# EAGLE design sensors_board (EAGLE 5.11)

## Sheet 1 of 2
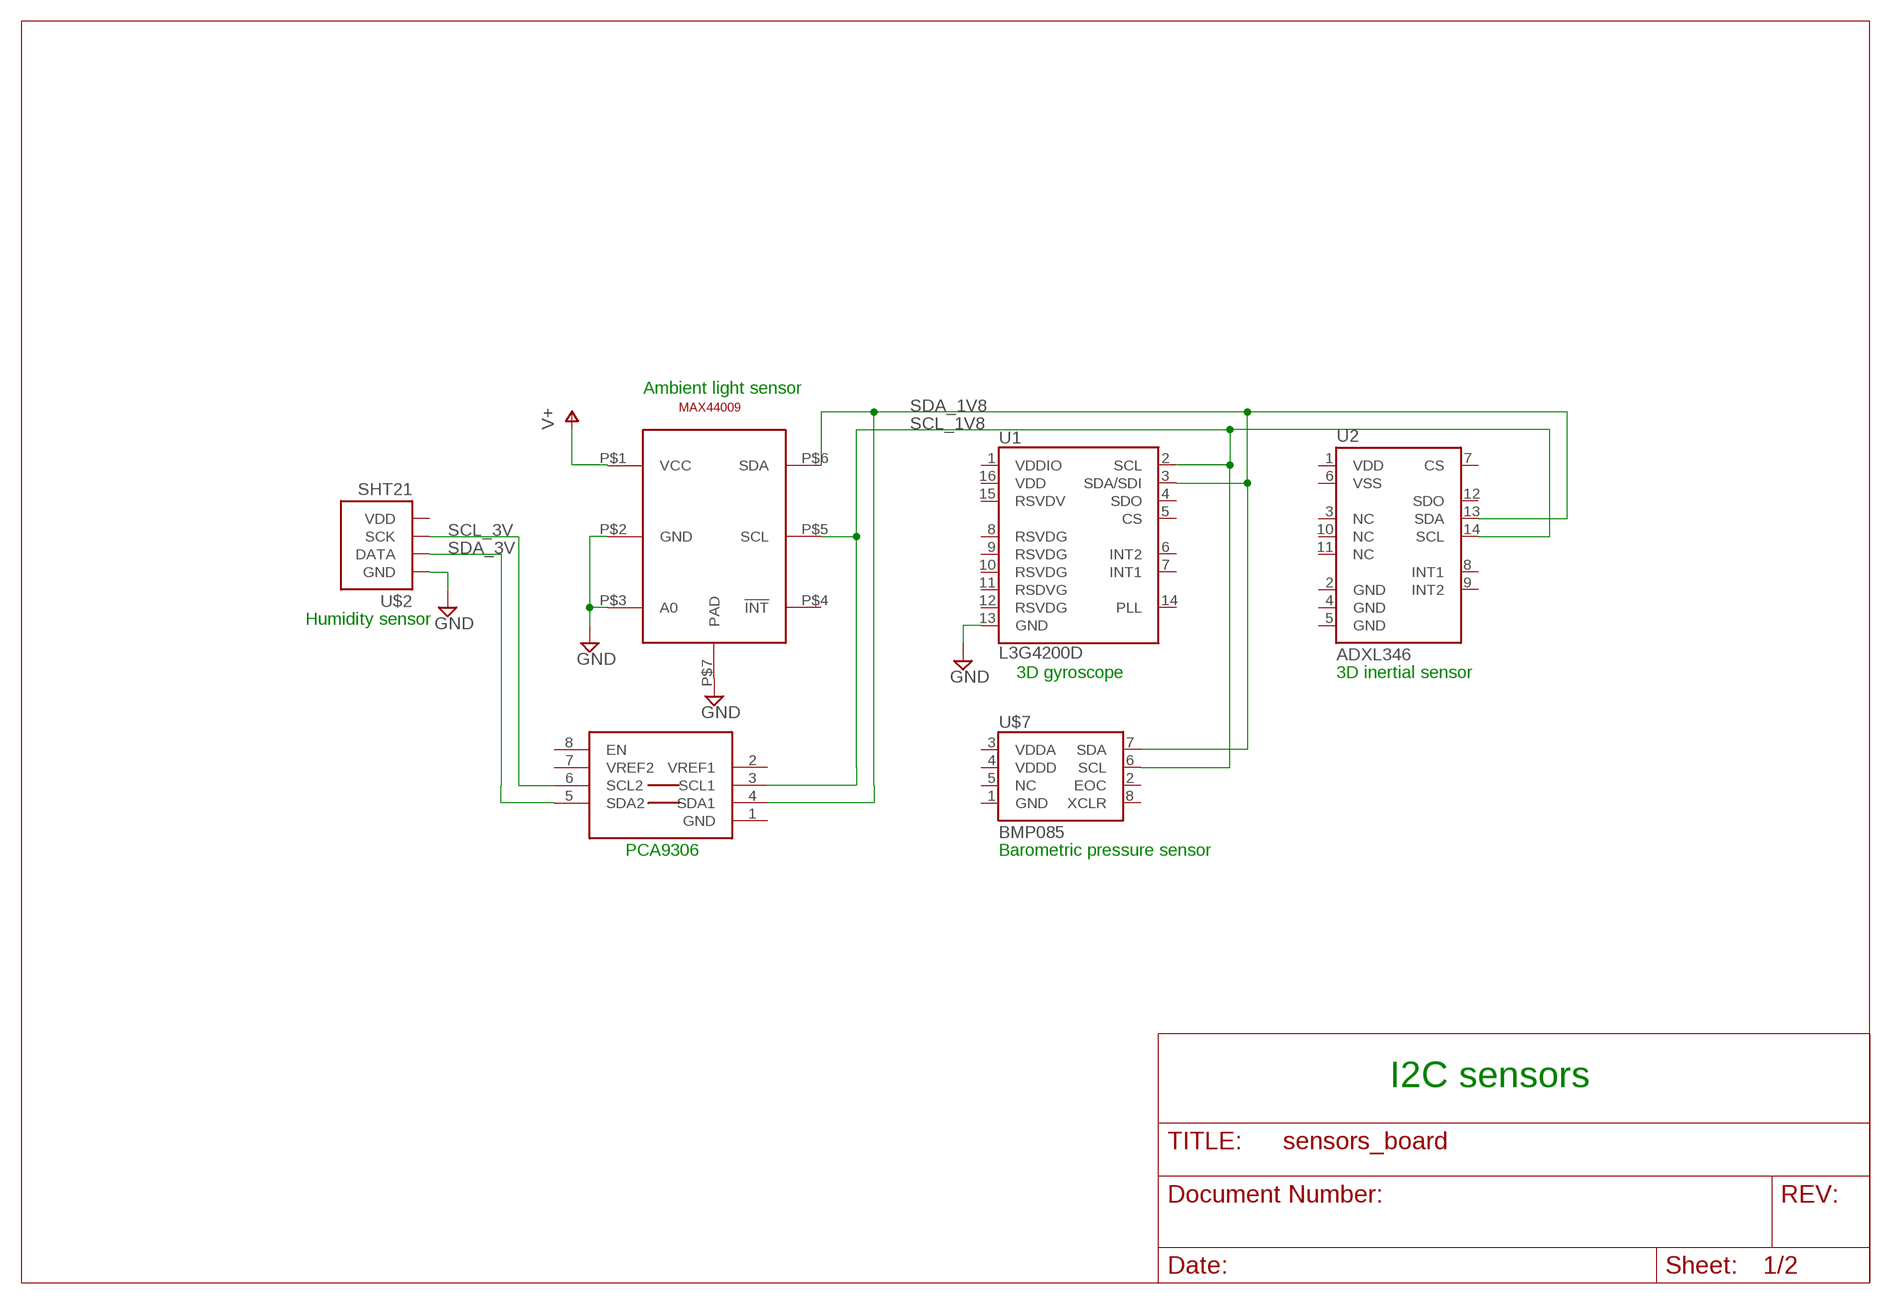
[diagram p0: schematic, sheet 1]

### Parts
U1  L3G4200D  [LGA16-4X4]
U2  ADXL346  ADXL345  [LGA14]
U$1  MAX44009EDT  [ODFN6]
U$2  SHT21  SHT1XSMD  [SHT1X]
U$6  PCA9306  [PSOP-8]
U$7  BMP085  [BMP085]

### Nets
GND: U1.13(GND) U$1.P$2(GND) U$1.P$3(A0) U$1.P$7(PAD) U$2.1(GND) ; also sheet 2
SCL_1V8: U1.2(SCL) U2.14(SCL) U$1.P$5(SCL) U$6.3(SCL1) U$7.6(SCL)
SCL_3V: U$2.3(SCK) U$6.6(SCL2)
SDA_1V8: U1.3(SDA/SDI) U2.13(SDA) U$1.P$6(SDA) U$6.4(SDA1) U$7.7(SDA)
SDA_3V: U$2.2(DATA) U$6.5(SDA2)
V+: U$1.P$1(VCC)
Unconnected: U1.1(VDDIO) U1.4(SDO) U1.5(CS) U1.6(INT2) U1.7(INT1) U1.8(RSVDG) U1.9(RSVDG) U1.10(RSVDG) U1.11(RSDVG) U1.12(RSVDG) U1.14(PLL) U1.15(RSVDV) U1.16(VDD) U2.1(VDD) U2.2(GND) U2.3(NC) U2.4(GND) U2.5(GND) U2.6(VSS) U2.7(CS) U2.8(INT1) U2.9(INT2) U2.10(NC) U2.11(NC) U2.12(SDO) U$1.P$4(!INT) U$6.1(GND) U$6.2(VREF1) U$6.7(VREF2) U$6.8(EN) U$7.2(EOC) U$7.5(NC) U$7.8(XCLR)

### Notes on the sheet
- Ambient light sensor
- Humidity sensor
- 3D gyroscope | 3D inertial sensor
- PCA9306 | Barometric pressure sensor
- I2C sensors

## Sheet 2 of 2
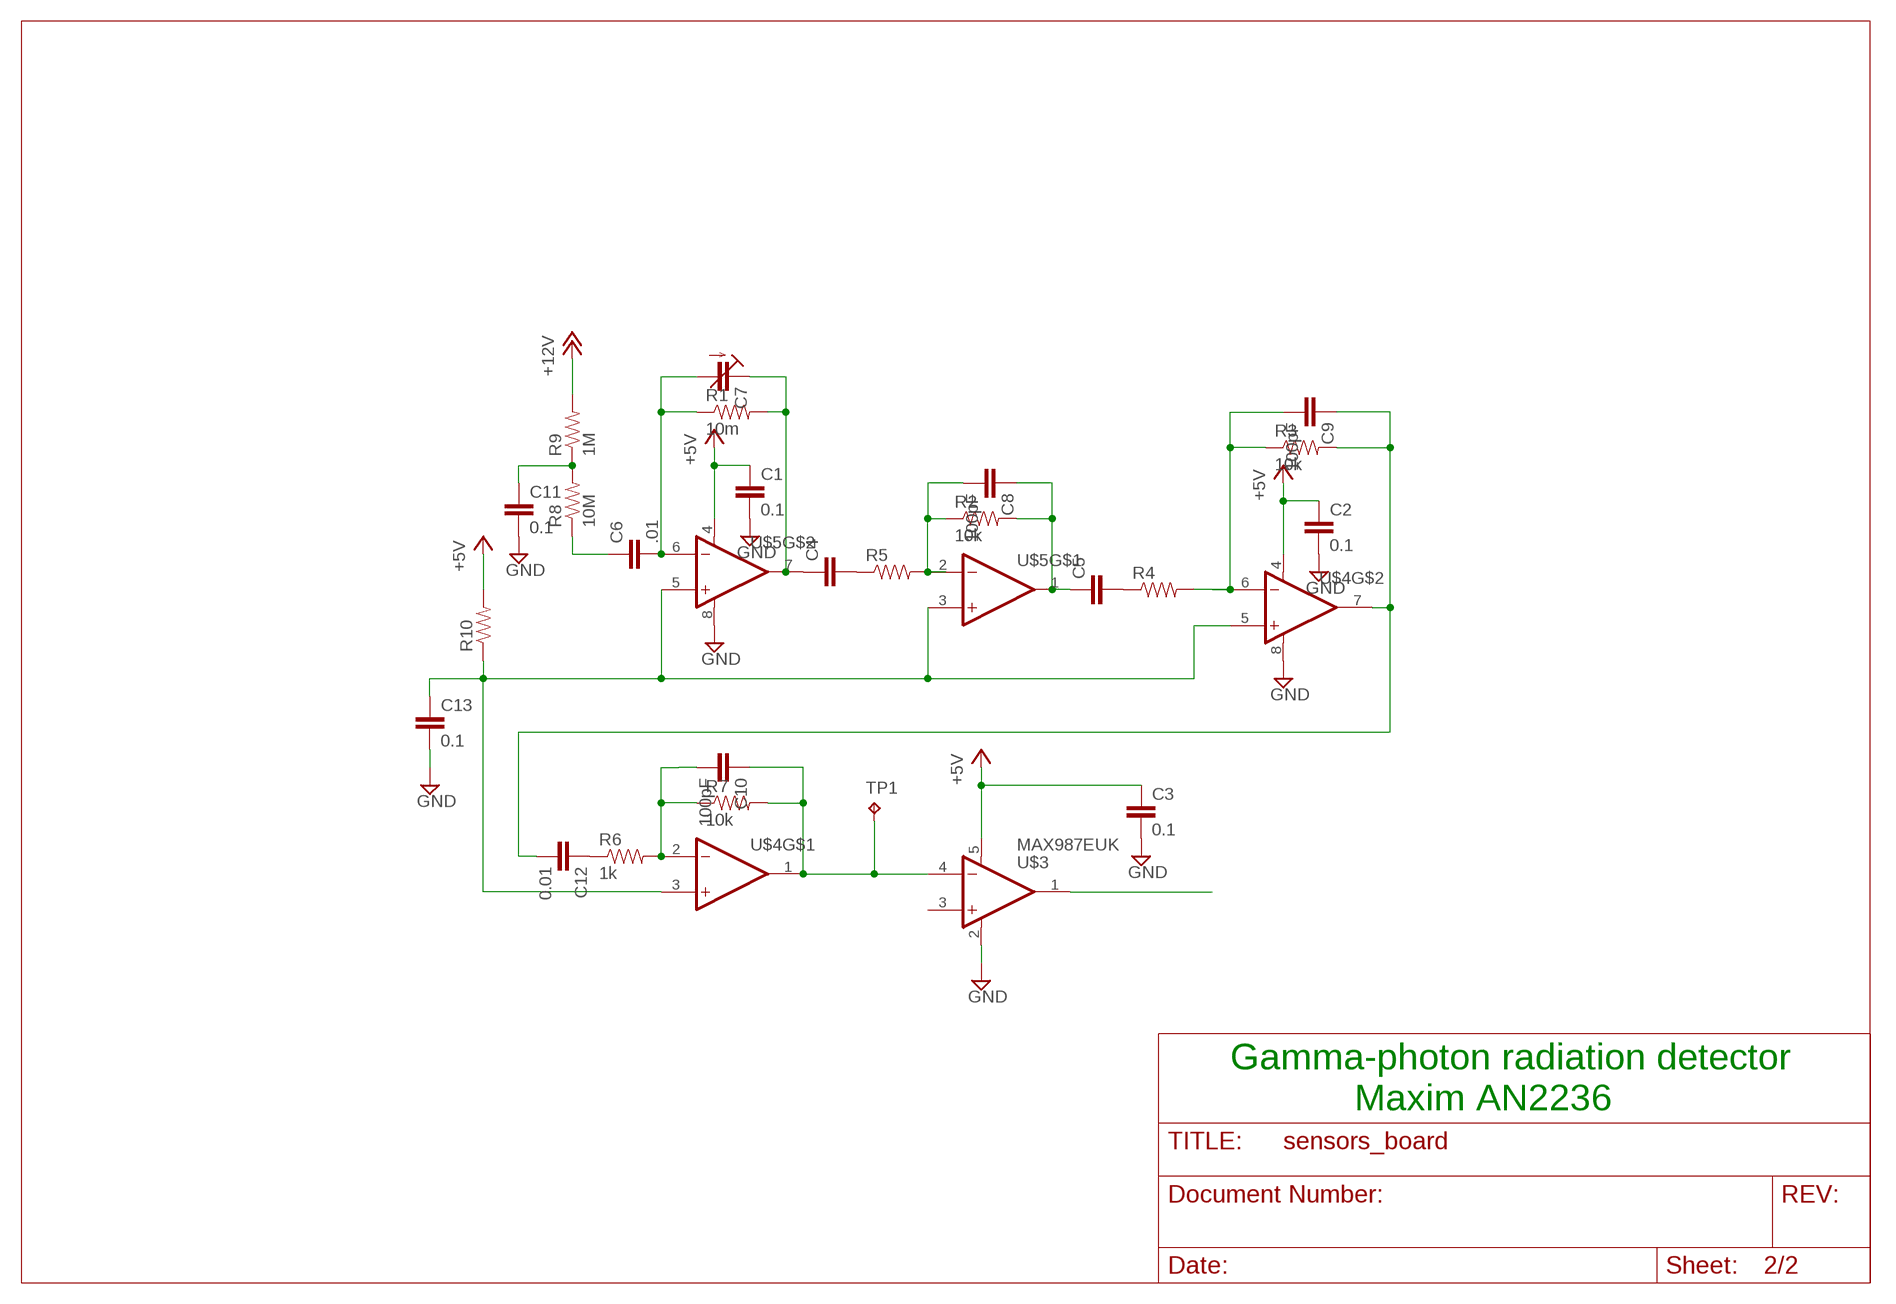
[diagram p1: schematic, sheet 2]

### Parts
C1  0.1  CAP0603-CAP  [0603-CAP]
C2  0.1  CAP0603-CAP  [0603-CAP]
C3  0.1  CAP0603-CAP  [0603-CAP]
C4  CAP0603-CAP  [0603-CAP]
C5  CAP0603-CAP  [0603-CAP]
C6  .01  CAP0603-CAP  [0603-CAP]
C7  C-TRIMM3018_11  [CTRIM3018_11]
C8  100pF  CAP0603-CAP  [0603-CAP]
C9  100pF  CAP0603-CAP  [0603-CAP]
C10  100pF  CAP0603-CAP  [0603-CAP]
C11  0.1  CAP0603-CAP  [0603-CAP]
C12  0.01  CAP0603-CAP  [0603-CAP]
C13  0.1  CAP0603-CAP  [0603-CAP]
R1  10m  RESISTOR0603-RES  [0603-RES]
R2  10k  RESISTOR0603-RES  [0603-RES]
R3  10k  RESISTOR0603-RES  [0603-RES]
R4  RESISTOR0603-RES  [0603-RES]
R5  RESISTOR0603-RES  [0603-RES]
R6  1k  RESISTOR0603-RES  [0603-RES]
R7  10k  RESISTOR0603-RES  [0603-RES]
R8  10M  RESISTOR0603-RES  [0603-RES]
R9  1M  RESISTOR0603-RES  [0603-RES]
R10  RESISTOR0603-RES  [0603-RES]
TP1  TPB1,27  [B1,27]
U$3  MAX987EUK  [SOT23-5]
U$4  MAX4477AUA  [UMAX8]
U$5  MAX4477AUA  [UMAX8]

### Nets
+5V: C1.1 C2.1 C3.1 R10.2 U$3.5(V-) U$4.4(V-) U$5.4(V-)
+12V: R9.2
GND: C1.2 C2.2 C3.2 C11.2 C13.2 U$3.2(V+) U$4.8(V+) U$5.8(V+) ; also sheet 1
N$1: C4.1 U$5.7(OUT)
N$2: C5.1 C8.1 R2.2 U$5.1(OUT)
N$4: C9.2 R3.1 R4.2 U$4.6(-IN)
N$5: U$3.1(OUT)
N$6: C10.2 R6.2 R7.1 U$4.2(-IN)
N$7: C11.1 R8.2 R9.1
N$9: C6.1 R8.1
N$10: C6.2 C7.-(A) R1.1 U$5.6(-IN)
N$11: C7.+(E) R1.2
N$12: C8.2 R2.1 R5.2 U$5.2(-IN)
N$15: C9.1 C12.2 R3.2 U$4.7(OUT)
N$16: C4.2 R5.1
N$17: C5.2 R4.1
N$18: C12.1 R6.1
N$19: C10.1 R7.2 TP1.TP U$3.4(-IN) U$4.1(OUT)
N$22: C13.1 R10.1 U$4.3(+IN) U$4.5(+IN) U$5.3(+IN) U$5.5(+IN)
Unconnected: U$3.3(+IN)

### Notes on the sheet
- Gamma-photon radiation detector
- Maxim AN2236

## Power pins joined to a net without a drawn wire
GND: U$7.1(GND)
VDD: U$2.4(VDD)
VDDA: U$7.3(VDDA)
VDDD: U$7.4(VDDD)

## Library data of the parts
C1-C6 C8-C13 = SparkFun:CAP: Capacitor Standard 0603 ceramic capacitor, and 0.1" leaded capacitor.
C7 = rcl:C-TRIMM: Trimm capacitor
R1-R10 = SparkFun:RESISTOR: Resistor Basic schematic elements and footprints for 0603, 1206, and PTH resistors.
TP1 = testpad:TP: Test pad
U1 = SparkFun:L3G4200D: L3G4200D Three-axis, digital output gyroscope The L3G4200D is a low-power three-axis angular rate sensor, has a full scale of ±250/±500/±2000 dps and is capable of measuring rates with a user-selectable bandwidth. It includes a sensing element and an IC interface capable of providing the measured angular rate to the external world through a digital interface (I2C/SPI). Package: 4x4x1.1 LGA-16 (LGA16-4x4.PAC)
U2 = SparkFun:ADXL345
U$1 = samuel:MAX44009EDT
U$2 = SparkFun:SHT1X: SHT1x Humdity Sensor Sensirion humdity sensor. Schematic element and footprint proven. Spark Fun Electronics SKU : COM-08227
U$3 = samuel:MAX987EUK
U$4 U$5 = samuel:MAX4477AUA
U$6 = SparkFun:PCA9306
U$7 = SparkFun:BMP085: BMP085 Pressure Sensor Great little MEMS pressure sensor. SKU: COM-09603

## Board
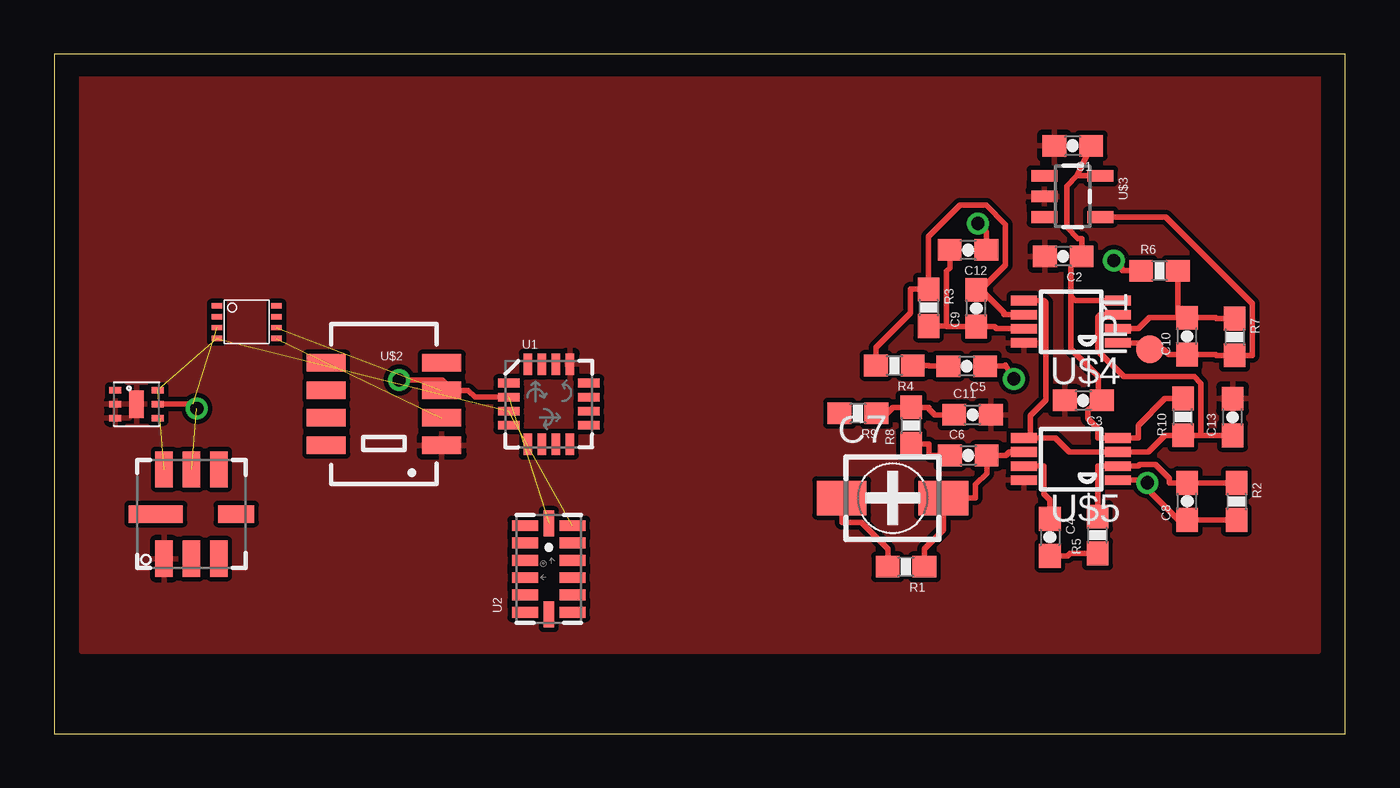
[diagram p2: board, top side]
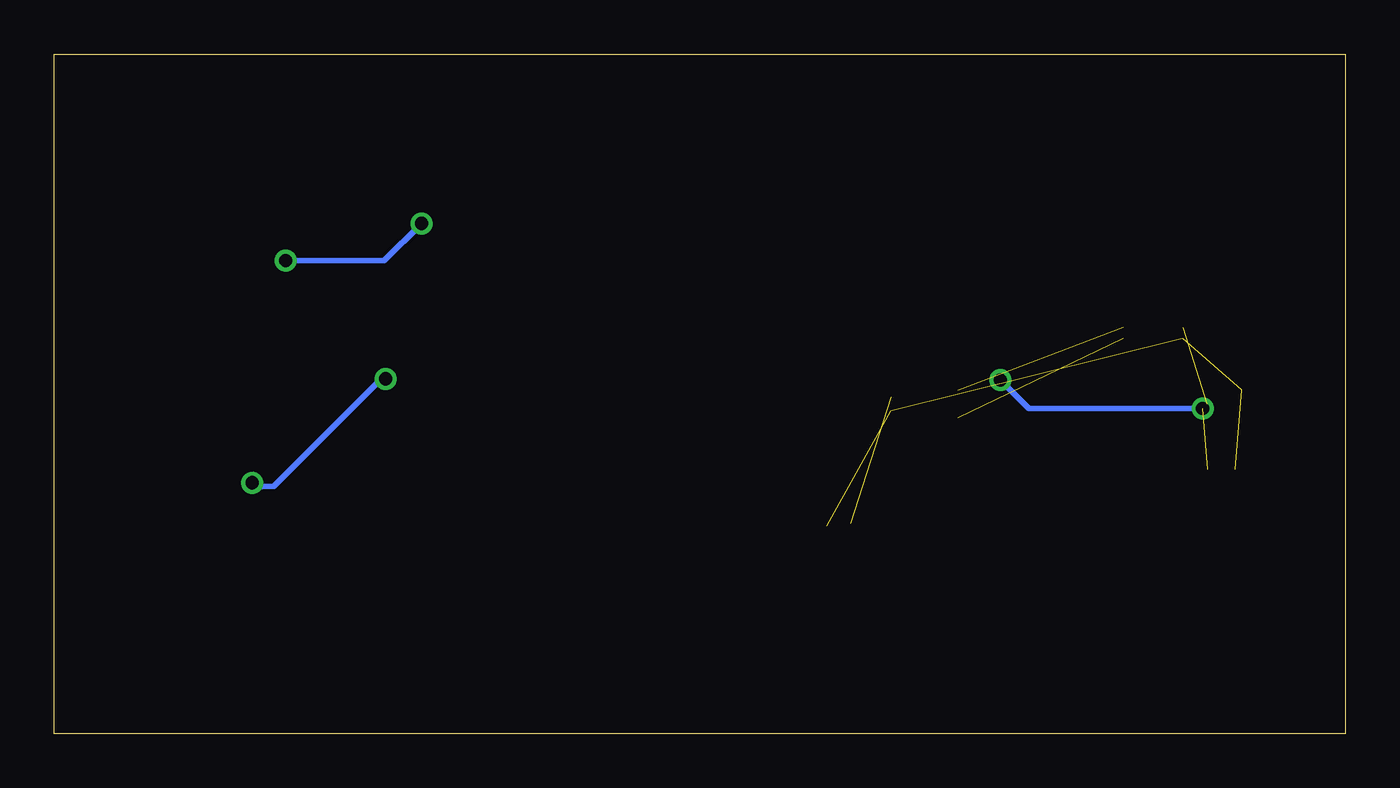
[diagram p3: board, bottom side, seen from below]

Size 59.67 x 31.42 mm. Coordinates in mm from the lower left corner, seen from the top.
Outline: 0,0 59.67,0 59.67,31.42 0,31.42 0,0
Copper layers (1*16): Top 0.035mm / dielectric 1.5mm / Bottom 0.035mm
Design rules "default": minimum track width 10mil, minimum drill 24mil, track to track 8mil, track to pad 8mil, pad to pad 8mil, via to via 8mil, smd to smd 8mil, copper to edge 40mil, drill to drill 8mil, minimum pad ring 10mil, minimum via ring 8mil, stop-mask expansion 4mil, vias tented up to drill 0mil, thermal gap 10mil

### Footprints (pad centres in the part's own frame; a part is rotated, then mirrored left to right if it is on the bottom)
0603-CAP = smd 1.1 x 1: 1 -0.85,0; 2 0.85,0
CTRIM3018_11 = smd 2.3 x 1.6: + -2.35,0; - 2.35,0
0603-RES = smd 1.1 x 1: 1 -0.85,0; 2 0.85,0
B1,27 = smd 1.27 x 1.27: TP 0,0
LGA16-4X4 = smd 1 x 0.4: 1 -1.85,0.975; 2 -1.85,0.325; 3 -1.85,-0.325; 4 -1.85,-0.975; 9 1.85,-0.975; 10 1.85,-0.325; 11 1.85,0.325; 12 1.85,0.975 | smd 0.4 x 1: 5 -0.975,-1.85; 6 -0.325,-1.85; 7 0.325,-1.85; 8 0.975,-1.85; 13 0.975,1.85; 14 0.325,1.85; 15 -0.325,1.85; 16 -0.975,1.85
LGA14 = smd 0.5 x 1.2: 1 2,1.1; 2 1.2,1.1; 3 0.4,1.1; 4 -0.4,1.1; 5 -1.2,1.1; 6 -2,1.1; 8 -2,-1.1; 9 -1.2,-1.1; 10 -0.4,-1.1; 11 0.4,-1.1; 12 1.2,-1.1; 13 2,-1.1 | smd 1.2 x 0.5: 7 -2.1,0; 14 2.1,0
ODFN6 = smd 0.55 x 0.3: P$1 -0.98,0.65; P$2 -0.98,0; P$3 -0.98,-0.65; P$4 0.98,-0.65; P$5 0.98,0; P$6 0.98,0.65 | smd 0.66 x 1.27: P$7 0,0
SHT1X = smd 1.8 x 0.8: 1 -2.667,1.905; 2 -2.667,0.635; 3 -2.667,-0.635; 4 -2.667,-1.905; 5 2.667,-1.905; 6 2.667,-0.635; 7 2.667,0.635; 8 2.667,1.905
SOT23-5 = smd 0.55 x 1.2: 1 -0.95,-1.3; 2 0,-1.3; 3 0.95,-1.3; 4 0.95,1.3; 5 -0.95,1.3
UMAX8 = smd 0.45 x 1.2: 1 -0.975,-2.175; 2 -0.325,-2.175; 3 0.325,-2.175; 4 0.975,-2.175; 5 0.975,2.175; 6 0.325,2.175; 7 -0.325,2.175; 8 -0.975,2.175
PSOP-8 = smd 0.25 x 0.5: 1 -0.73,-1.37; 2 -0.23,-1.37; 3 0.27,-1.37; 4 0.77,-1.37; 5 0.77,1.38; 6 0.27,1.38; 7 -0.23,1.38; 8 -0.73,1.38
BMP085 = smd 1.67 x 0.8: 1 -2.065,1.27; 2 -2.065,0; 3 -2.065,-1.27; 5 2.065,-1.27; 6 2.065,0; 7 2.065,1.27 | smd 0.8 x 1.67: 4 0,-2.065 | smd 0.8 x 2.5: 8 0,1.65

### Placement (x,y rotation side)
C1  47.07,27.18 180 top
C2  46.63,22.07 180 top
C3  47.56,15.41 180 top
C4  46.01,9.08 270 top
C5  42.17,16.99 180 top
C6  42.24,12.87 0 top
C7  38.75,10.9 0 top
C8  52.36,10.74 90 top
C9  42.61,19.68 90 top
C10  52.35,18.38 90 top
C11  42.44,14.75 0 top
C12  42.24,22.37 180 top
C13  54.46,14.64 90 top
R1  39.37,7.72 180 top
R2  54.63,10.74 270 top
R3  40.41,19.7 270 top
R4  38.83,17.02 180 top
R5  48.22,9.19 90 top
R6  51.08,21.41 0 top
R7  54.55,18.35 270 top
R8  39.6,14.25 90 top
R9  37.15,14.82 180 top
R10  52.17,14.65 90 top
TP1  50.63,17.78 90 top
U1  22.86,15.24 0 top
U2  22.86,7.62 90 top
U$1  3.81,15.24 0 top
U$2  15.24,15.24 180 top
U$3  47.06,24.84 270 top
U$4  46.99,19.05 90 top
U$5  46.99,12.7 90 top
U$6  8.89,19.05 270 top
U$7  6.35,10.16 90 top

### Tracks (layer width: path | path; a pad name or v marks a point on that pad's centre or on a via)
+5V
  Top 0.254: R10.2 51.34,15.5 50.09,14.26 50.09,13.68 U$5.4 48.23,13.68 48.23,14.12 47.78,14.58 47.78,15 C3.1 48.26,15.24 48.26,16.51 46.99,17.78 46.99,20.32 | 47.26,25.79 U$3.5 | 47.26,25.79 47.28,25.82 C1.1 | 47.26,25.79 46.79,25.33 46.79,23.42 47.31,22.9 47.48,22.9 C2.1 46.99,21.59 46.99,20.32 | U$4.4 47.28,20.02 arc-90 46.99,20.32
GND
  pour Top: 1.27,3.81 1.27,30.48 58.42,30.48 58.42,3.81
N$1
  Top 0.254: C4.1 46.02,10.81 45.74,11.08 45.74,12.38 U$5.7
N$2  (via drill 0.61 pad 1.02)
  Top 0.254: C5.1 43.9,16.99 43.95,17.05 v44.35,16.41 | U$5.1 49.63,11.72 50.4,11.72 v50.52,11.61 50.52,11.32 51.94,9.89 C8.1 53.8,9.89 R2.2
  Bottom 0.254: v44.35,16.41 44.45,16.51 49.53,11.43 50.8,11.43 v50.52,11.61
N$4
  Top 0.254: 42.82,20.53 43.97,21.68 43.97,23.54 43.07,24.43 41.87,24.43 40.41,22.97 R3.1 39.58,20.55 39.58,19.45 37.98,17.85 R4.2 | 42.82,20.53 43.88,19.46 43.88,19.38 U$4.6 | 42.82,20.53 C9.2
N$6
  Top 0.254: 51.93,19.23 C10.2 53.68,19.23 53.72,19.2 R7.1 | 51.93,19.23 50.6,19.23 50.09,18.73 U$4.2 | 51.93,19.23 R6.2
N$7
  Top 0.254: R9.1 38.5,14.82 38.77,15.1 R8.2 40.43,15.1 40.43,15.03 40.71,14.75 C11.1
N$9
  Top 0.254: R8.1 40.43,13.4 40.43,12.95 40.51,12.87 C6.1
N$10
  Top 0.254: U$5.6 44.13,13.03 43.97,12.87 C6.2 43.09,12.04 42.58,11.52 42.58,10.9 C7.- 41.1,9.43 40.22,8.55 R1.1
N$11
  Top 0.254: C7.+ 36.4,9.77 37.31,9.77 38.52,8.55 R1.2
N$12
  Top 0.254: R5.2 48.22,10.92 48.23,10.93 48.23,12.38 U$5.2 50.09,12.38 50.16,12.44 50.89,12.44 51.53,11.81 51.53,11.59 C8.2 53.8,11.59 R2.1
N$15
  Top 0.254: C12.2 41.39,21.54 41.24,21.39 41.24,18.85 | 41.24,18.85 41.26,18.83 C9.1 43.44,18.83 43.54,18.73 U$4.7 | R3.2 41.24,18.85
N$16
  Top 0.254: C4.2 46.84,8.23 46.95,8.34 R5.1
N$17
  Top 0.254: C5.2 40.44,16.99 40.41,17.02 R4.1
N$18  (via drill 0.61 pad 1.02)
  Top 0.254: R6.1 49.35,21.41 49.35,21.48 v48.97,21.87 | v42.69,23.6 43.09,23.2 C12.1
  Bottom 0.254: v42.69,23.6 44.41,21.87 v48.97,21.87
N$19
  Top 0.254: U$4.1 50.09,18.07 50.4,17.78 TP1.TP 51.28,17.78 51.52,17.54 C10.1 53.68,17.54 53.72,17.5 R7.2 55.38,17.5 55.38,19.89 51.37,23.89 U$3.4
N$22
  Top 0.254: 45.12,13.68 45.12,14.72 45.83,15.43 45.83,19.95 45.74,20.02 U$4.5 | 45.12,13.68 46.26,13.68 46.91,13.03 U$5.3 50.56,13.03 51.34,13.8 R10.1 53,13.8 | U$5.5 45.12,13.68 | 53,13.8 53,16.2 52.69,16.5 49.43,16.5 48.23,17.7 48.23,19.26 48.35,19.38 U$4.3 | C13.1 53.63,13.79 53.62,13.8 53,13.8
SCL_1V8  (via drill 0.61 pad 1.02)  (3 unrouted)
  Top 0.254: U$1.P$5 6.4,15.24 v6.6,15.04 | v15.94,16.35 17.93,16.35 18.41,15.88 19.14,15.88 19.45,15.56 U1.2
  Bottom 0.254: v15.94,16.35 14.63,15.04 v6.6,15.04
SCL_3V  (1 unrouted)
SDA_1V8  (4 unrouted)
SDA_3V  (1 unrouted)